# EAGLE design LB_BIT_o9_BARGRAPH-v02(rev1) (EAGLE 6.1)
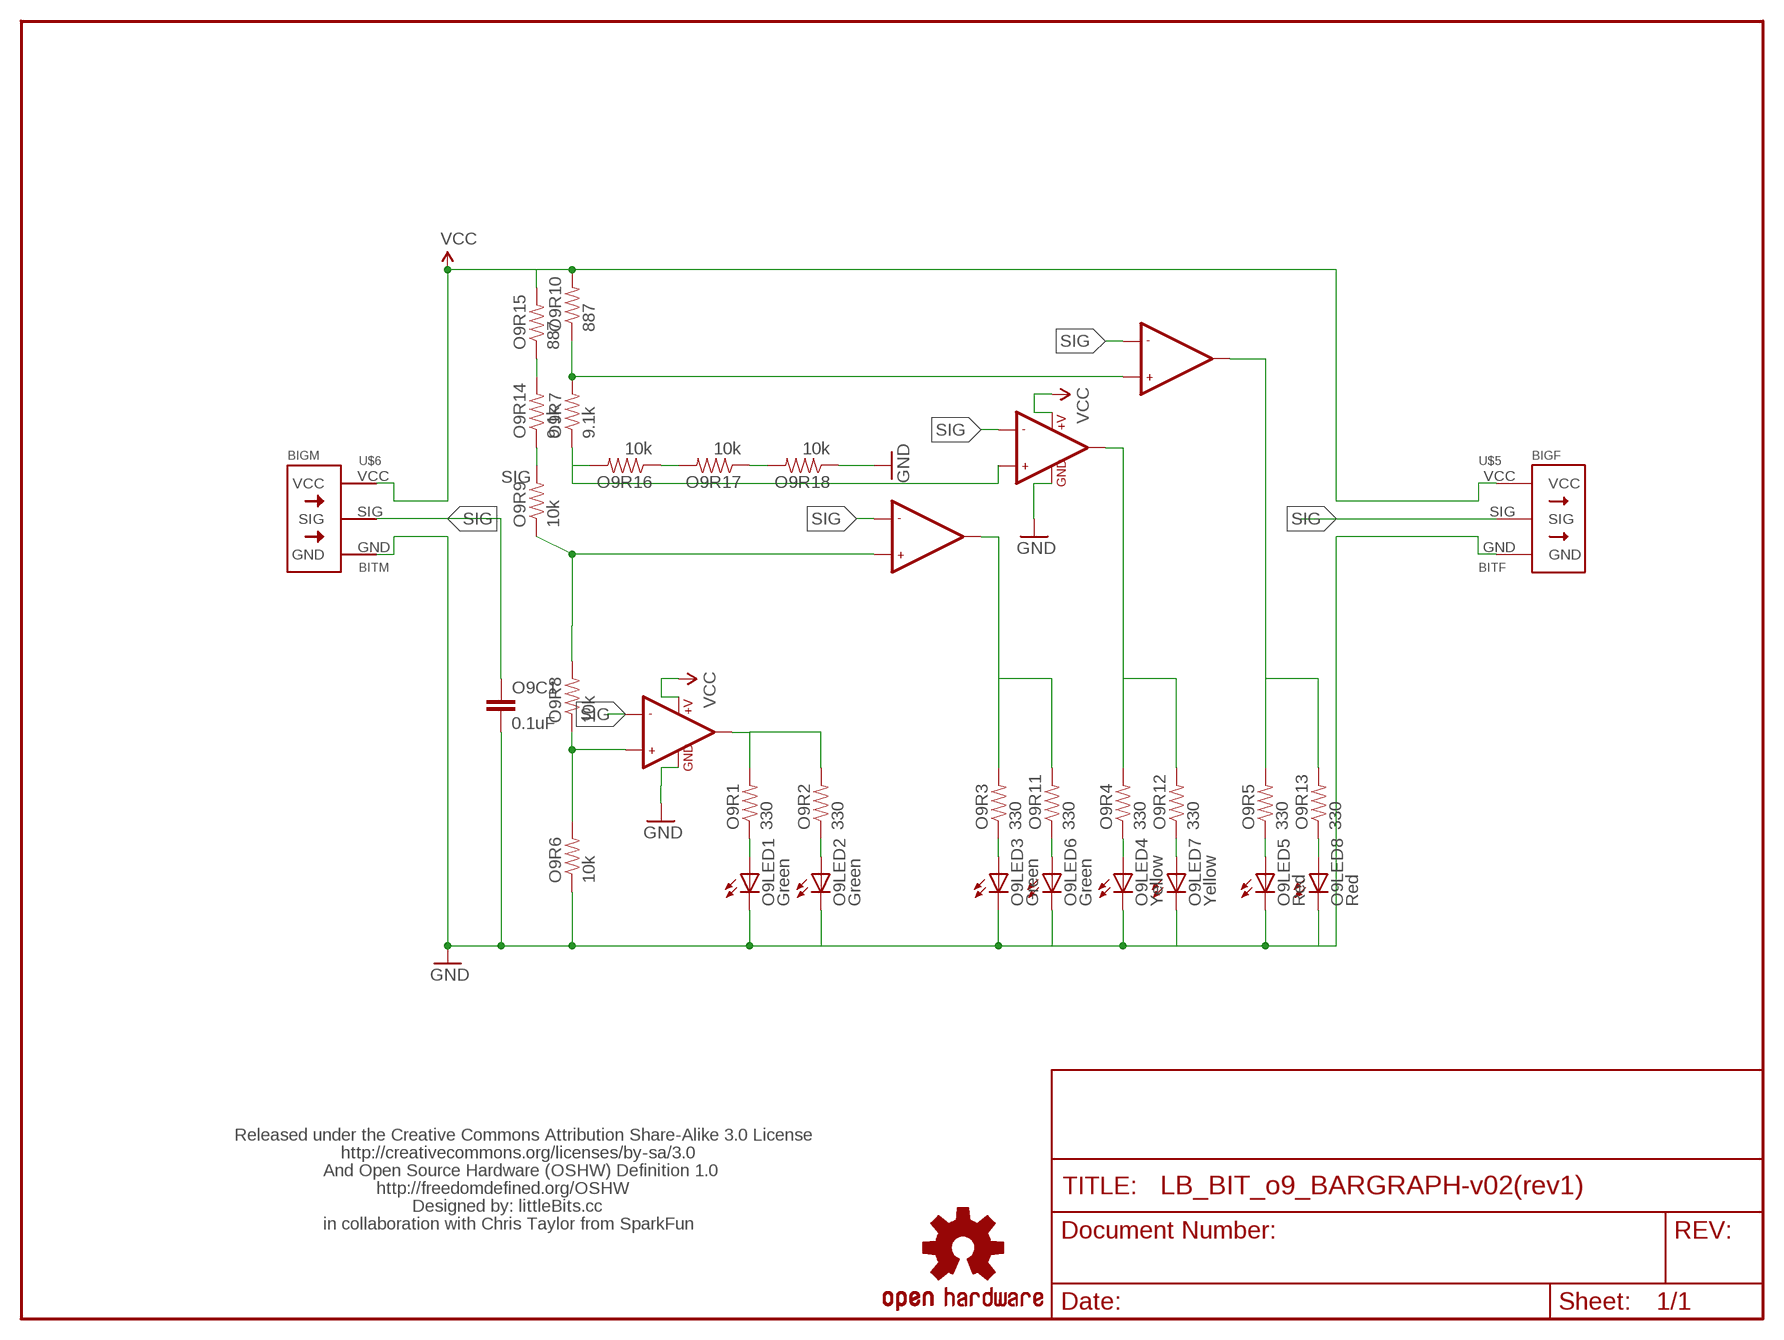
[diagram p0: schematic, sheet 1]

## Parts
O9C1  0.1uF  CAP0603-CAP  [0603-CAP]
O9LED1  Green  LED1206  [LED-1206]
O9LED2  Green  LED1206  [LED-1206]
O9LED3  Green  LED1206  [LED-1206]
O9LED4  Yellow  LED1206  [LED-1206]
O9LED5  Red  LED1206  [LED-1206]
O9LED6  Green  LED1206  [LED-1206]
O9LED7  Yellow  LED1206  [LED-1206]
O9LED8  Red  LED1206  [LED-1206]
O9R1  330  RESISTOR  [0805]
O9R2  330  RESISTOR  [0805]
O9R3  330  RESISTOR  [0805]
O9R4  330  RESISTOR  [0805]
O9R5  330  RESISTOR  [0805]
O9R6  10k  RESISTOR  [0805]
O9R7  9.1k  RESISTOR  [0805]
O9R8  10k  RESISTOR  [0805]
O9R9  10k  RESISTOR  [0805]
O9R10  887  RESISTOR  [0805]
O9R11  330  RESISTOR  [0805]
O9R12  330  RESISTOR  [0805]
O9R13  330  RESISTOR  [0805]
O9R14  9.1k  RESISTOR  [0805]
O9R15  887  RESISTOR  [0805]
O9R16  10k  RESISTOR  [0805]
O9R17  10k  RESISTOR  [0805]
O9R18  10k  RESISTOR  [0805]
U$1  LB_CREDITS  [OSHWCREDIT]
U$2  LMV358  [SO08]
U$3  OSHW-LOGOL  [OSHW-LOGO-L]
U$4  LMV358  [SO08]
U$5  BITF  [BITM]
U$6  BITM  [BITM]

## Nets
GND: O9C1.2 O9LED1.C O9LED2.C O9LED3.C O9LED4.C O9LED5.C O9LED6.C O9LED7.C O9LED8.C O9R6.1 O9R18.1 U$2.4(GND) U$4.4(GND) U$5.GND U$6.GND
N$1: O9R1.2 O9R2.2 U$2.1(OUT1)
N$2: O9LED1.A O9R1.1
N$3: O9R14.2 O9R15.1
N$4: O9LED3.A O9R3.1
N$5: O9LED4.A O9R4.1
N$6: O9LED5.A O9R5.1
N$7: O9LED8.A O9R13.1
N$8: O9R9.2 O9R14.1
N$9: O9LED7.A O9R12.1
N$10: O9LED6.A O9R11.1
N$11: O9R3.2 O9R11.2 U$2.7(OUT2)
N$12: O9R4.2 O9R12.2 U$4.1(OUT1)
N$13: O9R5.2 O9R13.2 U$4.7(OUT2)
N$14: O9R6.2 O9R8.1 U$2.3(+IN1)
N$15: O9R7.1 O9R16.2 U$4.3(+IN1)
N$16: O9R8.2 O9R9.1 U$2.5(+IN2)
N$17: O9R16.1 O9R17.2
N$18: O9R17.1 O9R18.2
N$19: O9LED2.A O9R2.1
N$20: O9R7.2 O9R10.1 U$4.5(+IN2)
SIG: O9C1.1 U$2.2(-IN1) U$2.6(-IN2) U$4.2(-IN1) U$4.6(-IN2) U$5.SIG U$6.SIG
VCC: O9R10.2 O9R15.2 U$2.8(+V) U$4.8(+V) U$5.VCC U$6.VCC

## Library data of the parts
O9C1 = SparkFun:CAP: Capacitor Standard 0603 ceramic capacitor, and 0.1" leaded capacitor.
O9LED1-O9LED8 = SparkFun:LED: LEDs Standard schematic elements and footprints for 5mm, 3mm, 1206, and 0603 sized LEDs. 5mm - Spark Fun Electronics SKU : COM-00529 (and others)
O9R1-O9R18 = SparkFun:RESISTOR: Resistor Basic schematic elements and footprints for 0603, 1206, and PTH 1/10th watt (small) resistors.
U$1 = LITTLEBITS:LB_CREDITS
U$2 U$4 = SparkFun:LMV358
U$3 = SparkFun:OSHW-LOGO: Open Source Hardware Logo This logo indicates the piece of hardware it is found on incorporates a OSHW license and/or adheres to the definition of open source hardware found here: http://freedomdefined.org/OSHW
U$5 = _Rada:BITF
U$6 = _Rada:BITM

## Board
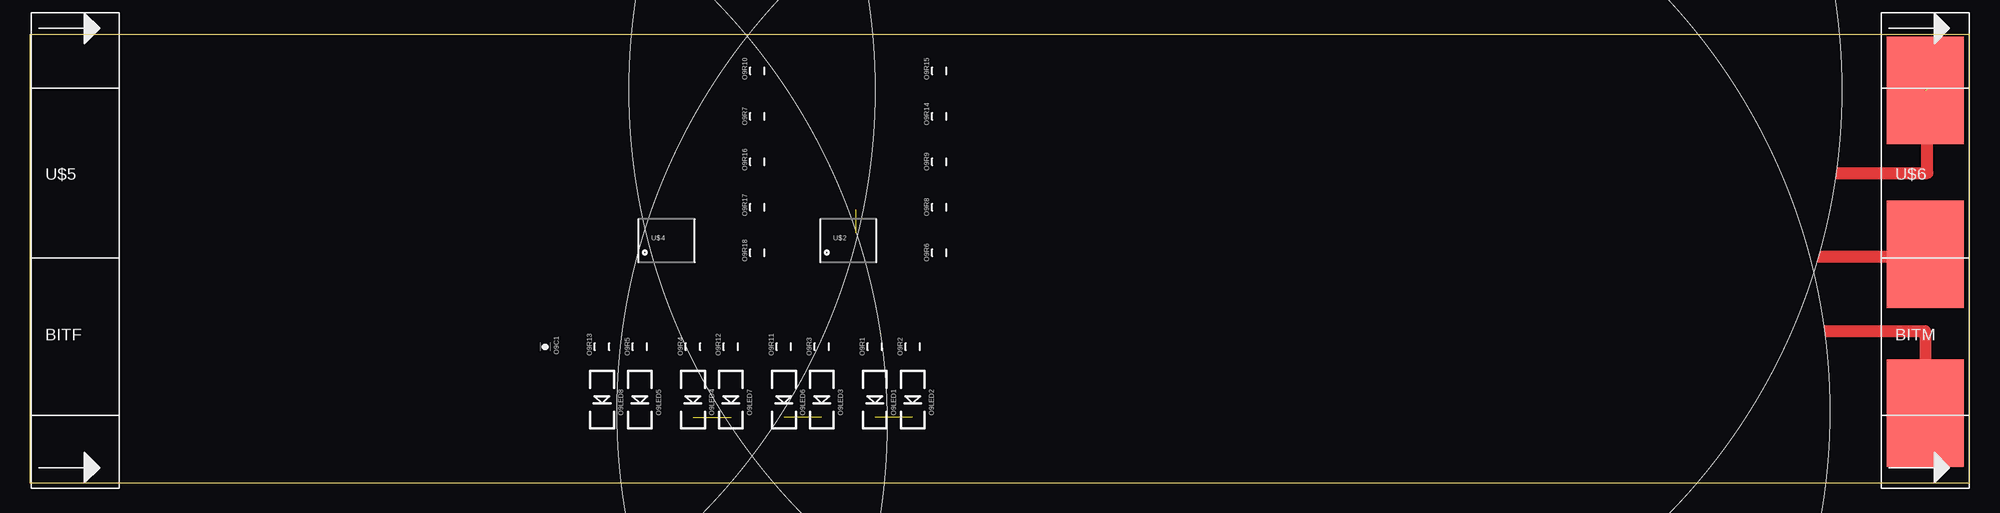
[diagram p1: board, top side]
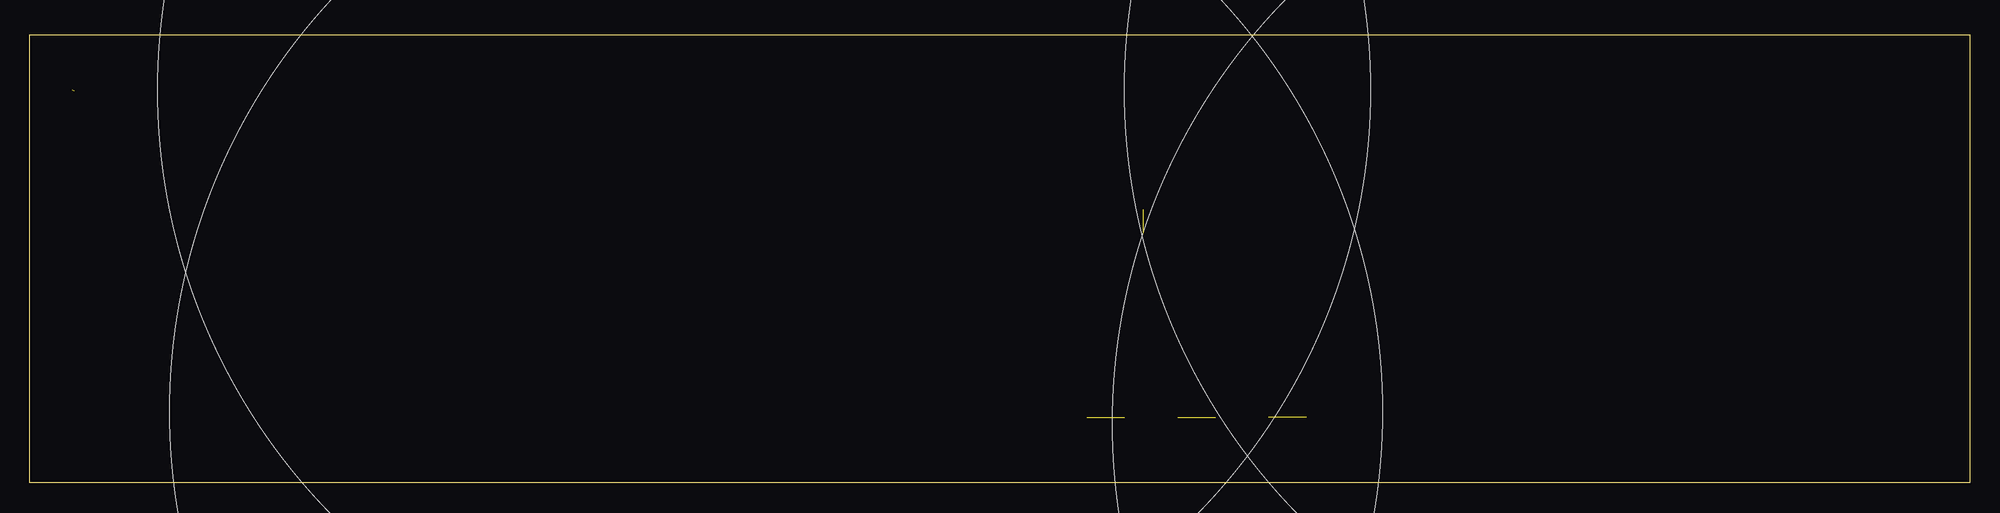
[diagram p2: board, bottom side, seen from below]

Size 162.54 x 37.58 mm. Coordinates in mm from the lower left corner, seen from the top.
Outline: 0,0 162.54,0 162.54,37.58 0,37.58 0,0
Copper layers (1*16): Top 0.035mm / dielectric 1.5mm / Bottom 0.035mm
Design rules: minimum track width 10mil, minimum drill 24mil, track to track 8mil, track to pad 8mil, pad to pad 8mil, via to via 8mil, smd to smd 8mil, copper to edge 40mil, drill to drill 8mil, minimum pad ring 10mil, minimum via ring 8mil, stop-mask expansion 4mil, vias tented up to drill 0mil, thermal gap 10mil
Holes 101.6 mm at 20,33 21,5 100,6 101,33

### Footprints (pad centres in the part's own frame; a part is rotated, then mirrored left to right if it is on the bottom)
0603-CAP = smd 1.1 x 1: 1 -0.85,0; 2 0.85,0
LED-1206 = smd 1.2 x 1.4: A -1.5,0; C 1.5,0
0805 = smd 0.8 x 1.2: 1 -0.9,0; 2 0.9,0
SO08 = smd 0.61 x 2.21: 1 -1.905,-2.616; 2 -0.635,-2.616; 3 0.635,-2.616; 4 1.905,-2.616; 5 1.905,2.616; 6 0.635,2.616; 7 -0.635,2.616; 8 -1.905,2.616
BITM = smd 6.452 x 8.992: GND 3.81,-13.145; SIG 3.81,0.191; VCC 3.81,13.906

### Placement (x,y rotation side)
O9C1  43.18,11.43 270 top
O9LED1  70.8,6.99 270 top
O9LED2  73.98,6.99 270 top
O9LED3  66.36,6.99 270 top
O9LED4  55.56,6.99 270 top
O9LED5  51.12,6.99 270 top
O9LED6  63.18,6.99 270 top
O9LED7  58.74,6.99 270 top
O9LED8  47.94,6.99 270 top
O9R1  70.8,11.43 90 top
O9R2  73.98,11.43 90 top
O9R3  66.36,11.43 90 top
O9R4  55.56,11.43 90 top
O9R5  51.12,11.43 90 top
O9R6  76.2,19.32 90 top
O9R7  60.96,30.75 90 top
O9R8  76.2,23.13 90 top
O9R9  76.2,26.94 90 top
O9R10  60.96,34.56 90 top
O9R11  63.18,11.43 90 top
O9R12  58.74,11.43 90 top
O9R13  47.94,11.43 90 top
O9R14  76.2,30.75 90 top
O9R15  76.2,34.56 90 top
O9R16  60.96,26.94 90 top
O9R17  60.96,23.13 90 top
O9R18  60.96,19.32 90 top
U$1  -48.26,1.27 0 top  (outside the outline)
U$2  68.58,20.32 0 top
U$3  -31.75,30.48 0 top  (outside the outline)
U$4  53.34,20.32 0 top
U$5  0,19 0 top
U$6  155,19 0 top

### Tracks (layer width: path | path; a pad name or v marks a point on that pad's centre or on a via)
GND  (3 unrouted)
  Top 0.406: O9C1.2 43.18,1.27 | 70.48,17.14 U$2.4 76.12,17.7 76.2,17.78 | U$4.4 60.96,17.7 | O9R18.1 60.96,17.7 | 60.96,17.7 60.96,1.27 | O9R6.1 76.2,17.78 | 76.2,17.78 76.2,1.27 | O9LED8.C 47.94,1.27 | O9LED5.C 51.12,1.27 | O9LED4.C 55.56,1.27 | O9LED7.C 58.74,1.27 | O9LED6.C 63.18,1.27 | O9LED3.C 66.36,1.27 | O9LED1.C 70.8,1.27 | O9LED2.C 73.98,1.27
  Top 0.5: 43.18,1.27 43,1.27 43,1 | 47.94,1.27 48,1.27 48,1 | 51.12,1.27 51,1.27 51,1 | 58.74,1.27 59,1.27 59,1 | 63.18,1.27 63,1.27 63,1 | 60.96,1.27 61,1.27 61,1 | 73.98,1.27 74,1.27 74,1 | 76.2,1.27 76,1.27 76,1
  Top 1: U$5.GND 4,5.86 4,12 40,12 40,1 43,1 48,1 51,1 59,1 61,1 63,1 74,1 76,1 81,1 81,12.75 158.81,12.75 U$6.GND
N$1
  Top 0.406: O9R1.2 70.8,15.56 | O9R2.2 73.98,15.56 70.8,15.56 | U$2.1 66.67,15.56 68.26,15.56 70.8,15.56
N$2
  Top 0.406: O9R1.1 O9LED1.A
N$3
  Top 0.406: O9R15.1 O9R14.2
N$4
  Top 0.406: O9R3.1 O9LED3.A
N$5
  Top 0.406: O9R4.1 O9LED4.A
N$6
  Top 0.406: O9LED5.A O9R5.1
N$7
  Top 0.406: O9R13.1 O9LED8.A
N$8
  Top 0.406: O9R14.1 O9R9.2
N$9
  Top 0.406: O9R12.1 O9LED7.A
N$10
  Top 0.406: O9LED6.A O9R11.1
N$11
  Top 0.406: O9R3.2 66.36,13.97 64.77,13.97 | O9R11.2 63.18,13.02 63.18,13.97 64.77,13.97 | U$2.7 67.94,21.59 66.67,20.32 64.77,20.32 64.77,13.97
N$12
  Top 0.406: U$4.1 51.44,15.56 53.02,15.56 54.29,15.56 55.56,15.56 | 55.56,15.56 O9R4.2 | O9R12.2 58.74,15.56 55.56,15.56
N$13
  Top 0.406: U$4.7 52.7,21.59 51.44,20.32 49.53,20.32 49.53,13.97 | O9R5.2 51.12,13.97 49.53,13.97 | O9R13.2 47.94,13.97 49.53,13.97
N$14
  Top 0.406: O9R8.1 76.2,21.23 | 76.2,21.23 O9R6.2 | U$2.3 69.22,19.37 70.17,20.32 73.34,20.32 73.34,21.23 76.2,21.23
N$15
  Top 0.406: O9R7.1 60.96,28.84 | 60.96,28.84 O9R16.2 | U$4.3 53.98,19.37 54.93,20.32 58.1,20.32 58.1,28.84 60.96,28.84
N$16
  Top 0.406: O9R9.1 76.2,25.04 | 76.2,25.04 O9R8.2 | U$2.5 70.48,25.04 76.2,25.04
N$17
  Top 0.406: O9R16.1 O9R17.2
N$18
  Top 0.406: O9R17.1 O9R18.2
N$19
  Top 0.406: O9R2.1 O9LED2.A
N$20
  Top 0.406: O9R10.1 60.96,32.66 | 60.96,32.66 O9R7.2 | U$4.5 55.24,32.66 60.96,32.66
SIG  (via drill 0.5 pad 1.27)  (1 unrouted)
  Top 0.406: U$4.2 52.7,19.68 53.98,20.95 U$4.6 v53.98,29.21 | U$2.2 67.94,19.68 69.22,20.95 v69.22,29.21 | 79,29 v79.06,29.21 | O9C1.1 43.18,19 v43.18,29.21
  Top 0.5: 40,19 43.18,19 | 79,29 79,19 81,19
  Top 1: U$5.SIG 5,19.19 3,19 40,19 | 81,19 158,19 U$6.SIG
  Bottom 0.406: v43.18,29.21 v53.98,29.21 v69.22,29.21 v79.06,29.21
VCC  (1 unrouted)
  Top 0.4: 81,37 76.2,37 O9R15.2
  Top 0.406: U$4.8 51.44,36.87 | U$2.8 66.67,36.37
  Top 0.5: 66.67,36.37 66.67,36.67 67,37 | O9R10.2 61,35.46 61,37 | 51.44,36.87 51,36.87 51,37
  Top 1: U$5.VCC 4,32.91 4,26 40,26 40,37 51,37 61,37 67,37 81,37 81,26 159,26 159,33